# Altium schematic sheet 端子图.SchDoc
size A4
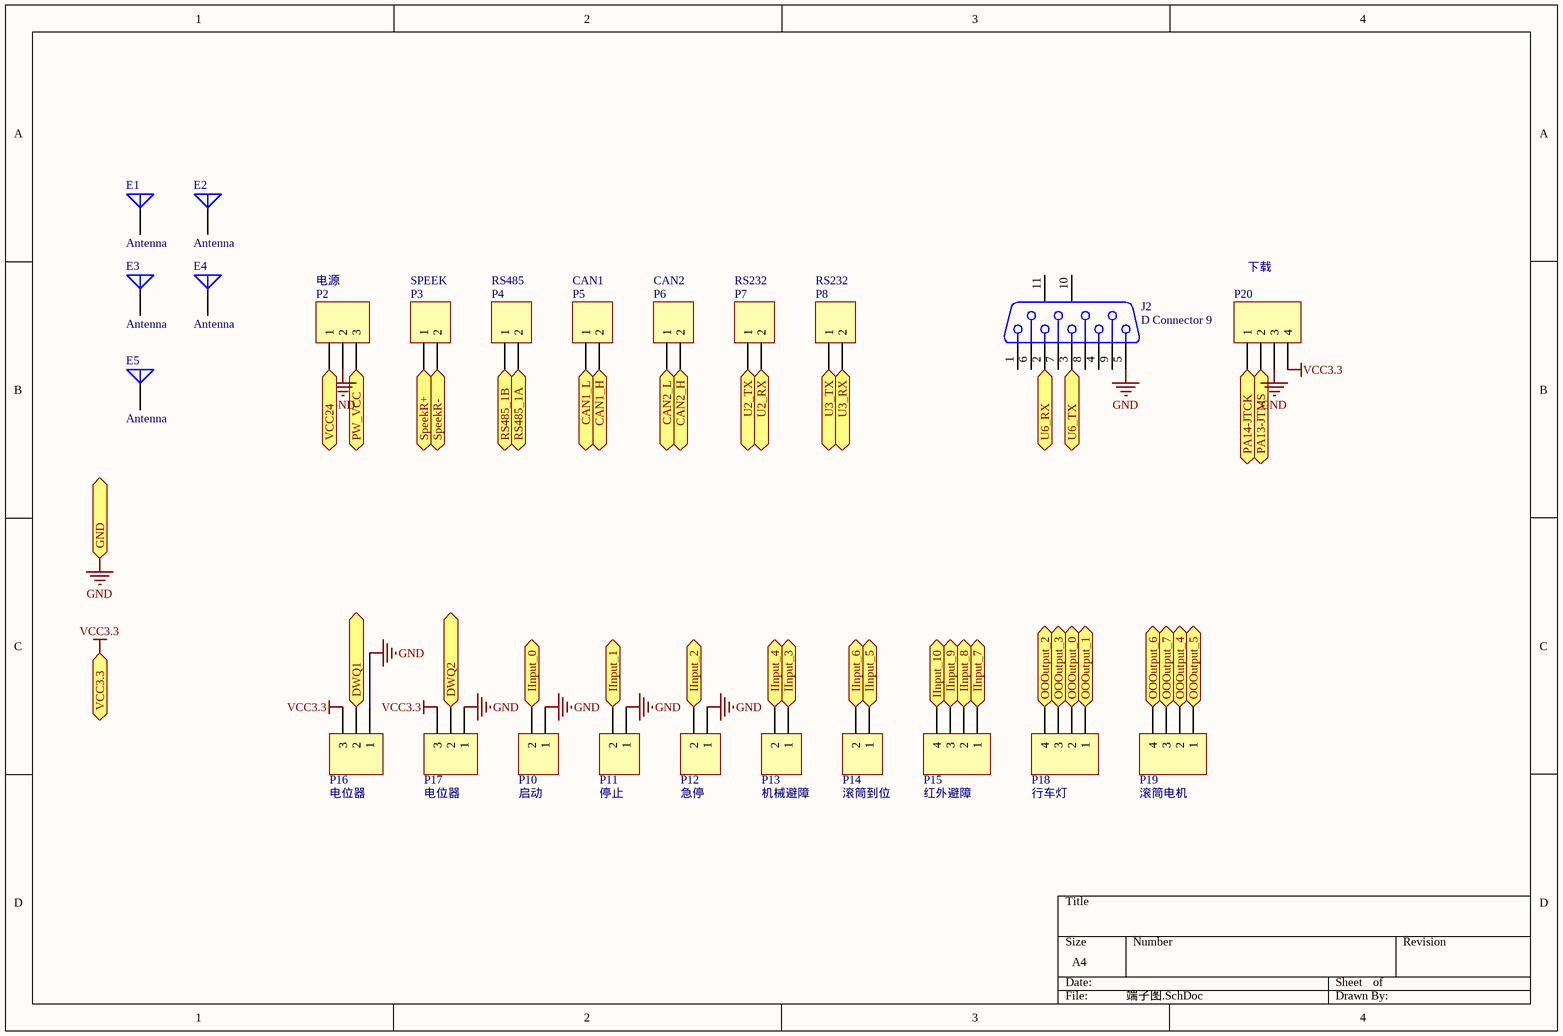
[diagram p0: 端子图.SchDoc]

## Parts
E1  Antenna  [定位孔 Φ3.2]
E2  Antenna  [定位孔 Φ3.2]
E3  Antenna  [定位孔 Φ3.2]
E4  Antenna  [定位孔 Φ3.2]
E5  Antenna  [定位孔 Φ3.2]
J2  D Connector 9  [DSUB1.385-2H9]
P2  电源  [DZ-3-5.08]
P3  SPEEK  [DZ-2-5.08]
P4  RS485  [DZ-2-5.08]
P5  CAN1  [DZ-2-5.08]
P6  CAN2  [DZ-2-5.08]
P7  RS232  [DZ-2-5.08]
P8  RS232  [DZ-2-5.08]
P10  启动  [DZ-2-5.08]
P11  停止  [DZ-2-5.08]
P12  急停  [DZ-2-5.08]
P13  机械避障  [DZ-2-5.08]
P14  滚筒到位  [DZ-2-5.08]
P15  红外避障  [DZ-4-5.08]
P16  电位器  [DZ-3-5.08]
P17  电位器  [DZ-3-5.08]
P18  行车灯  [DZ-4-5.08]
P19  滚筒电机  [DZ-4-5.08]
P20  下载  [DZ-4-5.08]

## Ports
CAN1_H, CAN1_L, CAN2_H, CAN2_L, DWQ1, DWQ2, GND, IInput_0, IInput_1, IInput_2, IInput_3, IInput_4, IInput_5, IInput_6, IInput_7, IInput_8, IInput_9, IInput_10, OOOutput_0, OOOutput_1, OOOutput_2, OOOutput_3, OOOutput_4, OOOutput_5, OOOutput_6, OOOutput_7, PA13-JTMS, PA14-JTCK, PW_VCC, RS485_1A, RS485_1B, SpeekR+, SpeekR-, U2_RX, U2_TX, U3_RX, U3_TX, U6_RX, U6_TX, VCC3.3, VCC24

## Nets
GND: J2.5 P2.2 P10.1 P11.1 P12.1 P16.1 P17.1 P20.3 ; port GND
VCC3.3: P16.3 P17.3 P20.4 ; port VCC3.3
CAN1_H: P5.2 ; port CAN1_H
CAN1_L: P5.1 ; port CAN1_L
CAN2_H: P6.2 ; port CAN2_H
CAN2_L: P6.1 ; port CAN2_L
DWQ1: P16.2 ; port DWQ1
DWQ2: P17.2 ; port DWQ2
IInput_0: P10.2 ; port IInput_0
IInput_1: P11.2 ; port IInput_1
IInput_2: P12.2 ; port IInput_2
IInput_3: P13.1 ; port IInput_3
IInput_4: P13.2 ; port IInput_4
IInput_5: P14.1 ; port IInput_5
IInput_6: P14.2 ; port IInput_6
IInput_7: P15.1 ; port IInput_7
IInput_8: P15.2 ; port IInput_8
IInput_9: P15.3 ; port IInput_9
IInput_10: P15.4 ; port IInput_10
OOOutput_0: P18.2 ; port OOOutput_0
OOOutput_1: P18.1 ; port OOOutput_1
OOOutput_2: P18.4 ; port OOOutput_2
OOOutput_3: P18.3 ; port OOOutput_3
OOOutput_4: P19.2 ; port OOOutput_4
OOOutput_5: P19.1 ; port OOOutput_5
OOOutput_6: P19.4 ; port OOOutput_6
OOOutput_7: P19.3 ; port OOOutput_7
PA13-JTMS: P20.2 ; port PA13-JTMS
PA14-JTCK: P20.1 ; port PA14-JTCK
PW_VCC: P2.3 ; port PW_VCC
RS485_1A: P4.2 ; port RS485_1A
RS485_1B: P4.1 ; port RS485_1B
SpeekR+: P3.1 ; port SpeekR+
SpeekR-: P3.2 ; port SpeekR-
U2_RX: P7.2 ; port U2_RX
U2_TX: P7.1 ; port U2_TX
U3_RX: P8.2 ; port U3_RX
U3_TX: P8.1 ; port U3_TX
U6_RX: J2.2 ; port U6_RX
U6_TX: J2.3 ; port U6_TX
VCC24: P2.1 ; port VCC24

Not connected (* = marked no-connect by the designer): E1 1(A); E2 1(A); E3 1(A); E4 1(A); E5 1(A); J2 1 4 6 7 8 9 10(MH1) 11(MH2)

## Library data of the parts
E1-E5 = Antenna: Generic Antenna; Published: 24-Mar-1999; LatestRevisionDate: 17-Jul-2002; LatestRevisionNote: Re-released for DXP Platform.; PackageReference: PIN1; Publisher: Altium Limited
J2 = D Connector 9: Receptacle Assembly, 9 Position, Right Angle; PackageDocument: O; Positions: 9; Published: 15-Jun-2001; LatestRevisionDate: 17-Jul-2002; LatestRevisionNote: Re-released for DXP Platform.; DatasheetDocument: 1-Sep-1999; PackageReference: 788750; Publisher: Altium Limited; Orientation: Right Angle; Gender: Receptacle
P2 P16 P17 = Header 3: Header, 3-Pin; LatestRevisionDate: 17-Jul-2002; LatestRevisionNote: Re-released for DXP Platform.; Publisher: Altium Limited
P3-P8 P10-P14 = Header 2: Header, 2-Pin; LatestRevisionDate: 17-Jul-2002; LatestRevisionNote: Re-released for DXP Platform.; Publisher: Altium Limited
P15 P18-P20 = Header 4: Header, 4-Pin; LatestRevisionDate: 17-Jul-2002; LatestRevisionNote: Re-released for DXP Platform.; Publisher: Altium Limited